# EasyEDA Pro project pcb最终版.epro, schematic master control
Create Date: 2023-09-30; Page Name: P1; Project Name: 工科大; Schematic Name: master control; Update Date: 2023-10-22; Company: 嘉立创EDA; Page Size: A4; Version: V1.0
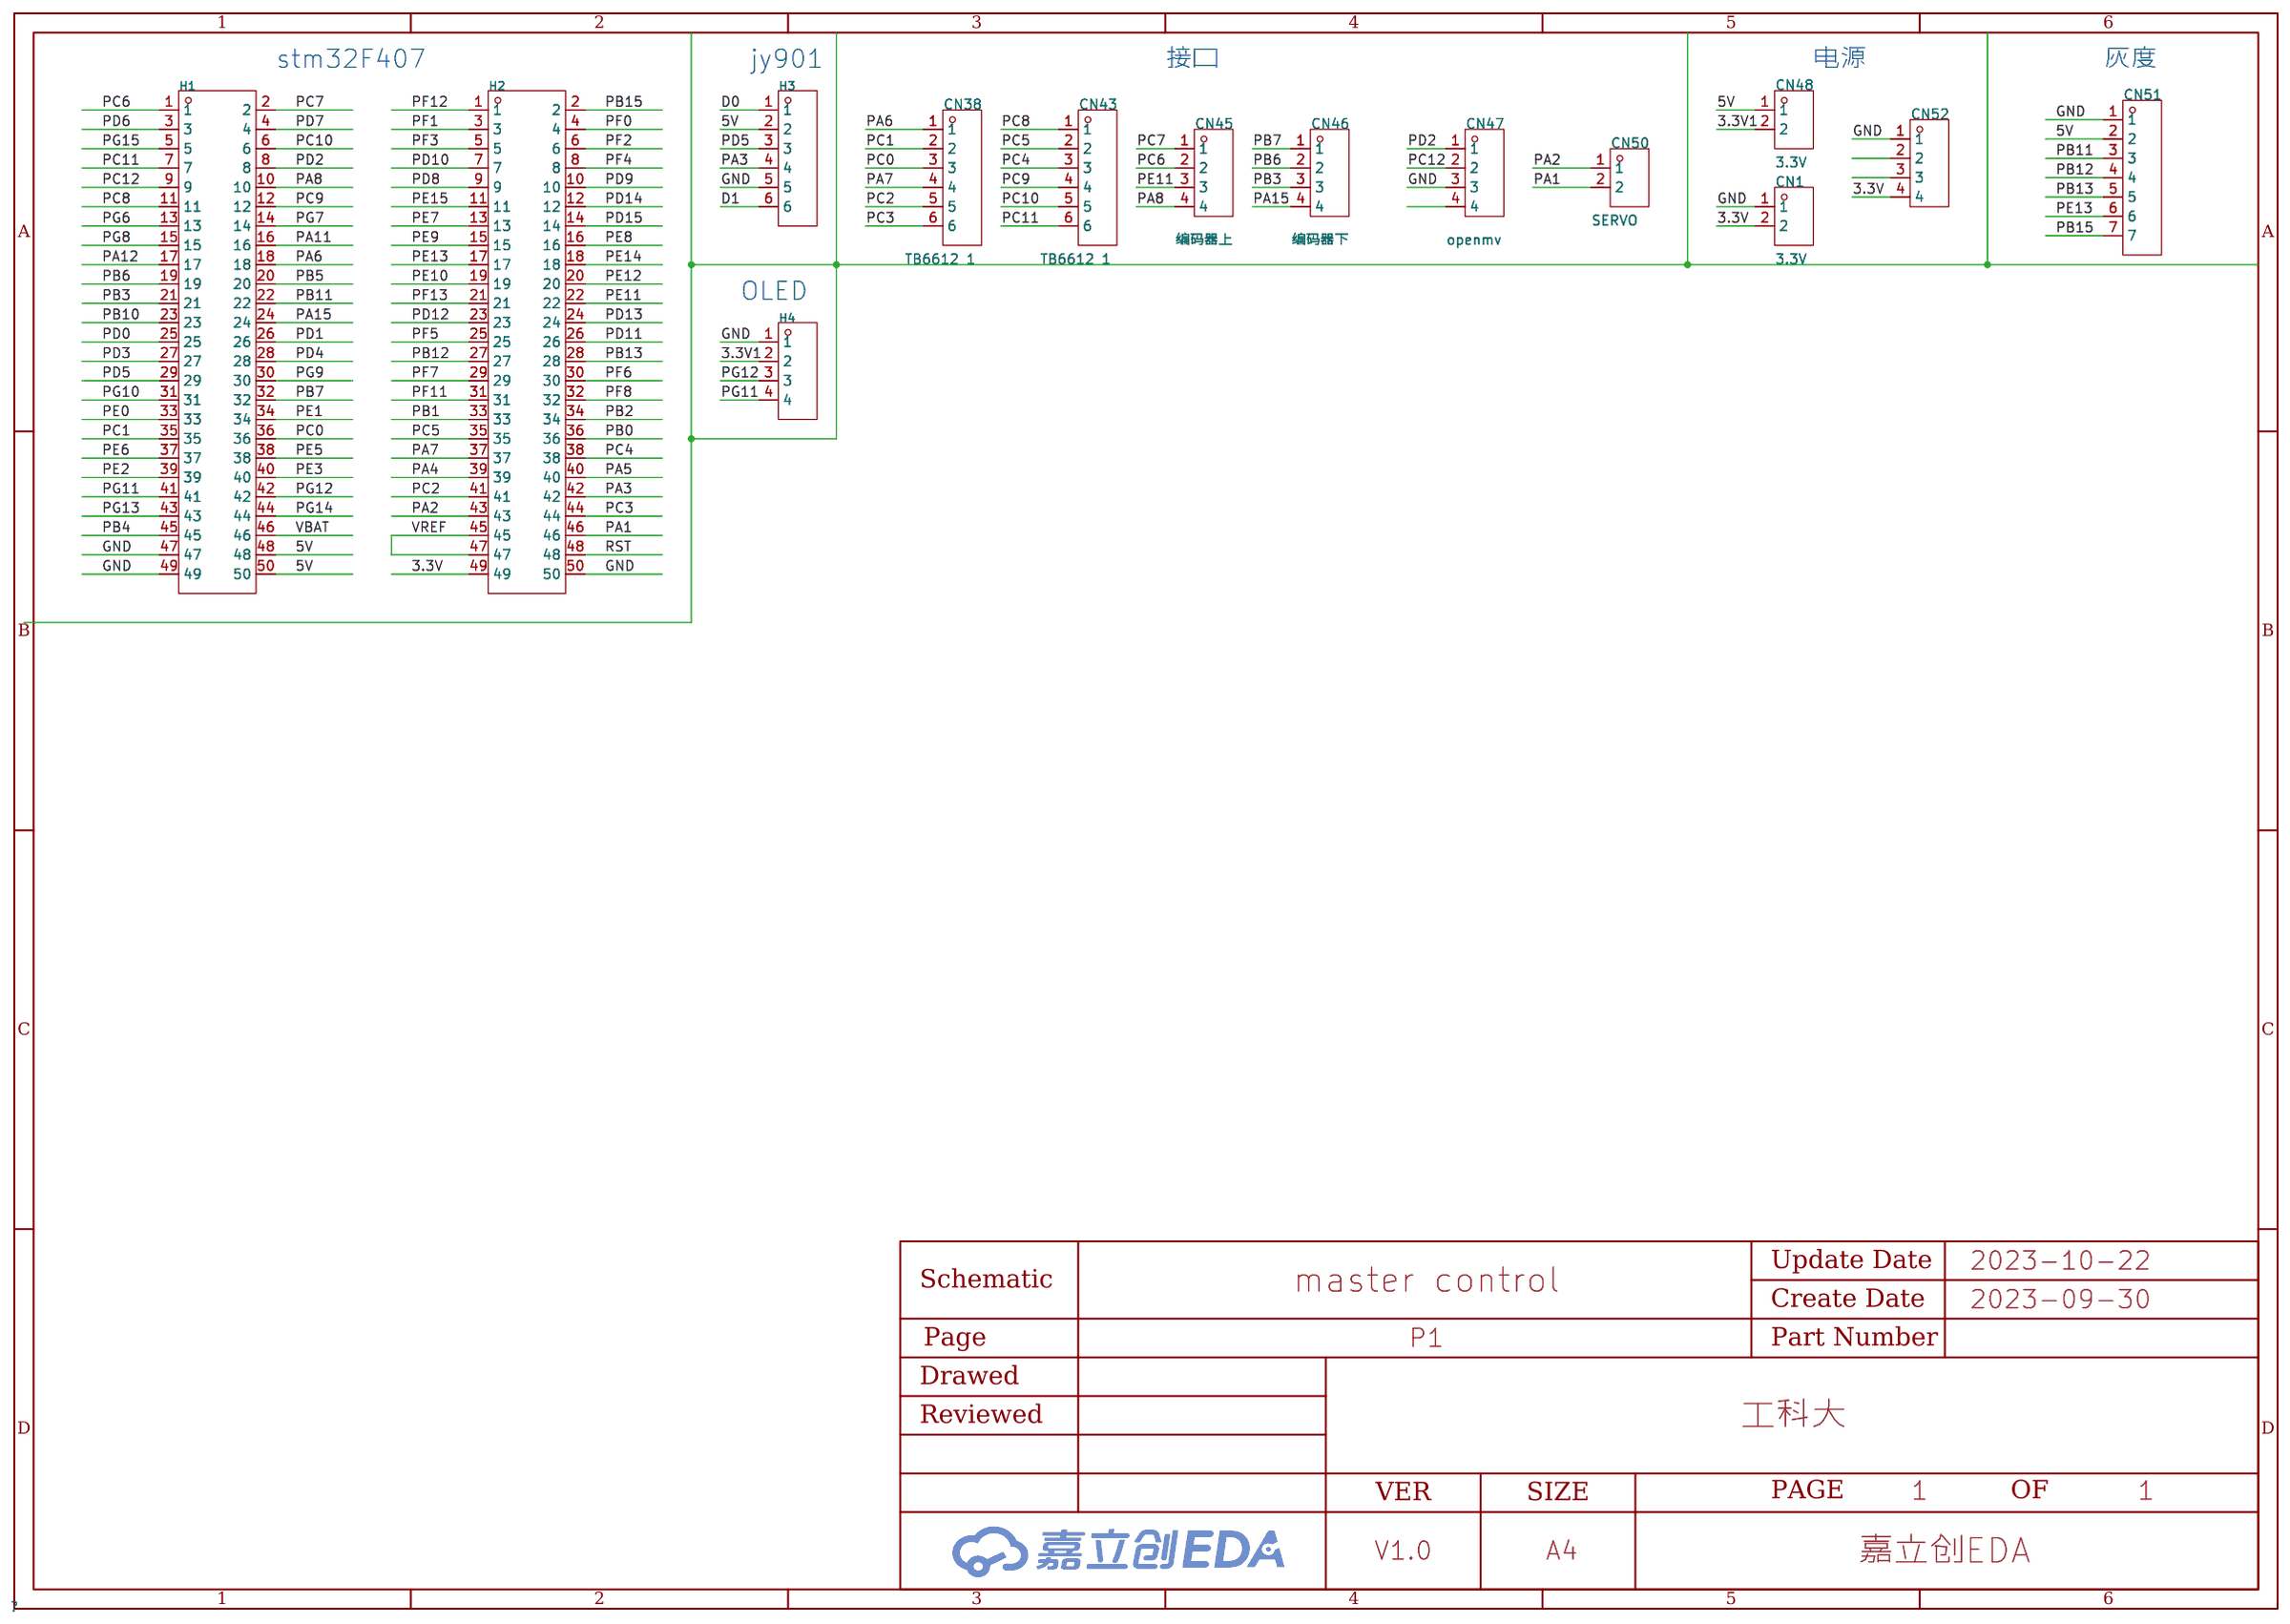
[diagram p2: schematic sheet]

## Parts
CN1  3.3V  [CONN-TH_XH-2AW_C2908611]
CN38  TB6612 1  [CONN-TH_6P-P2.50_HC-XH-6AW-G]
CN43  TB6612 1  [CONN-TH_6P-P2.50_HC-XH-6AW-G]
CN45  编码器上  [CONN-TH_XH-4AW]
CN46  编码器下  [CONN-TH_XH-4AW]
CN47  openmv  [CONN-TH_XH-4AW]
CN48  3.3V  [CONN-TH_XH-2AW_C2908611]
CN50  SERVO  [CONN-TH_XH-2AW_C2908611]
CN51  HC-XH-7AW-G  [CONN-TH_7P-P2.50_HC-XH-7AW-G]
CN52  XH-4AW  [CONN-TH_XH-4AW]
H1  FH-00077  [HDR-TH_50P-P2.54-V-F-R2-C25-S2.54-1]
H2  FH-00077  [HDR-TH_50P-P2.54-V-F-R2-C25-S2.54-1]
H3  PM254V-11-06-H85  [HDR-TH_6P-P2.54-V-F]
H4  PM254V-11-04-H85  [HDR-TH_4P-P2.54-V-F]

## Library data of the parts
CN1 CN48 CN50 = XH-2AW_C2908611: 参考系列:XH;间距:2.54mm;插针结构:1x2P;排数:1;每排PIN数:2;行距:-;公母:公型插针;安装方式:弯插;额定电流:3A;工作温度范围:-25℃~+85℃;; LCSC Part Name: XH 2.54mm 1x2P 弯插; Supplier Part: C2908611; Manufacturer: HCTL(华灿天禄); Supplier Footprint: 弯插,P=2.54mm; JLCPCB Part Class: 扩展库; Datasheet: https://atta.szlcsc.com/upload/public/pdf/source/20211021/ACA2D54D99493880102FCACAC8DAABA8.pdf; Supplier: LCSC; Reference Series: XH; Pitch: 2.54mm; Pins Structure: 1x2P; Number of Rows: 1; Number of PINs Per Row: 2; Gender: 公型插针; Mounting Style: 弯插; Current Rating (Max): 3A; Operating Temperature Range: -25℃~+85℃
CN38 CN43 = HC-XH-6AW-G: 参考系列:XH;间距:2.54mm;插针结构:1x6P;排数:1;每排PIN数:6;行距:2.54mm;公母:公型插针;安装方式:弯插;额定电流:3A;工作温度范围:-25℃~+85℃;; LCSC Part Name: XH 2.54mm 1x6P 弯插; Supplier Part: C5341212; Manufacturer: HCTL(华灿天禄); Supplier Footprint: 弯插,P=2.5mm; JLCPCB Part Class: 扩展库; Datasheet: https://atta.szlcsc.com/upload/public/pdf/source/20230105/4FFD2EFD3DA44AA828171A44400F3EDE.pdf; Supplier: LCSC; Reference Series: XH; Pitch: 2.54mm; Pins Structure: 1x6P; Number of Rows: 1; Number of PINs Per Row: 6; Row Spacing: 2.54mm; Gender: 公型插针; Mounting Style: 弯插; Current Rating (Max): 3A; Operating Temperature Range: -25℃~+85℃
CN45-CN47 CN52 = XH-4AW: 参考系列:XH;间距:2.54mm;插针结构:1x4P;排数:1;每排PIN数:4;行距:-;公母:公型插针;安装方式:弯插;额定电流:3A;工作温度范围:-25℃~+85℃;; LCSC Part Name: XH 2.54mm 1x4P 弯插; Supplier Part: C2908613; Manufacturer: HCTL(华灿天禄); Supplier Footprint: 插件,P=2.54mm; JLCPCB Part Class: 扩展库; Datasheet: https://atta.szlcsc.com/upload/public/pdf/source/20211021/ACA2D54D99493880102FCACAC8DAABA8.pdf; Supplier: LCSC; Reference Series: XH; Pitch: 2.54mm; Pins Structure: 1x4P; Number of Rows: 1; Number of PINs Per Row: 4; Gender: 公型插针; Mounting Style: 弯插; Current Rating (Max): 3A; Operating Temperature Range: -25℃~+85℃
CN51 = HC-XH-7AW-G: 参考系列:XH;间距:2.54mm;插针结构:1x7P;排数:1;每排PIN数:7;行距:2.54mm;公母:公型插针;安装方式:弯插;额定电流:3A;工作温度范围:-25℃~+85℃;; LCSC Part Name: XH 2.54mm 1x7P 弯插; Supplier Part: C5341213; Manufacturer: HCTL(华灿天禄); Supplier Footprint: 弯插,P=2.5mm; JLCPCB Part Class: 扩展库; Datasheet: https://atta.szlcsc.com/upload/public/pdf/source/20230105/4FFD2EFD3DA44AA828171A44400F3EDE.pdf; Supplier: LCSC; Reference Series: XH; Pitch: 2.54mm; Pins Structure: 1x7P; Number of Rows: 1; Number of PINs Per Row: 7; Row Spacing: 2.54mm; Gender: 公型插针; Mounting Style: 弯插; Current Rating (Max): 3A; Operating Temperature Range: -25℃~+85℃
H1 H2 = FH-00077: 排数:双排;总孔位数:50;间距:2.54mm;插孔结构:2x25P;行距:2.54mm;安装类型:直插;圆孔/方孔:方孔;额定电流:3A;额定电压:-;插孔方向:顶部;塑高:8.5mm;触头材质:黄铜;触头镀层:金;工作温度范围:-40℃~+105℃;焊接温度(最大值):200℃@10S;; LCSC Part Name: 2.54mm 2x25P; Supplier Part: C2829906; Manufacturer: Liansheng(连盛); Supplier Footprint: 直插,P=2.54mm; JLCPCB Part Class: 扩展库; Supplier: LCSC; Number of Rows: 双排; Number of Holes: 50; Pitch: 2.54mm; Holes Structure: 2x25P; Row Spacing: 2.54mm; Mounting Type: 直插; Circular Hole / Square Hole: 方孔; Current Rating (Max): 3A; Holes Direction: 顶部; Insulation Height: 8.5mm; Contact Material: 黄铜; Contact Plating: 金; Operating Temperature Range: -40℃~+105℃; Welding Temperature (Max): 200℃@10S
H3 = PM254V-11-06-H85: 排数:单排;总孔位数:6P;间距:2.54mm;插孔结构:1x6P;行距:-;安装类型:直插;圆孔/方孔:方孔;额定电流:3A;额定电压:250V;插孔方向:顶部;塑高:-;工作温度范围:-40℃~+105℃;; LCSC Part Name: 2.54mm 1x6P; Supplier Part: C2832269; Manufacturer: XFCN(兴飞); Supplier Footprint: 插件,P=2.54mm; JLCPCB Part Class: 扩展库; Datasheet: https://atta.szlcsc.com/upload/public/pdf/source/20210514/C2832269_B3EC97736B37C2783BDCE3050AA57447.pdf; Supplier: LCSC; Number of Rows: 单排; Number of Holes: 6P; Pitch: 2.54mm; Holes Structure: 1x6P; Mounting Type: 直插; Circular Hole / Square Hole: 方孔; Current Rating (Max): 3A; Voltage Rating (Max): 250V; Holes Direction: 顶部; Operating Temperature Range: -40℃~+105℃
H4 = PM254V-11-04-H85: 排数:单排;总孔位数:4;间距:2.54mm;插孔结构:1x4P;行距:-;安装类型:直插;塑高:-;触头材质:黄铜;触头镀层:-;; LCSC Part Name: 2.54mm 1x4P; Supplier Part: C541851; Manufacturer: XFCN(兴飞); Supplier Footprint: 直插,P=2.54mm; Supplier: LCSC; Number of Rows: 单排; Number of Holes: 4; Pitch: 2.54mm; Holes Structure: 1x4P; Mounting Type: 直插; Contact Material: 黄铜

## Nets
3.3V: CN1.2 CN52.4 H2.49
3.3V1: CN48.2 H4.2
5V: CN48.1 CN51.2 H1.48 H1.50 H3.2
GND: CN1.1 CN47.3 CN51.1 CN52.1 H1.47 H1.49 H2.50 H3.5 H4.1
VBAT: H1.46
D0: H3.1
D1: H3.6
PA1: CN50.2 H2.46
PA2: CN50.1 H2.43
PA3: H2.42 H3.4
PA4: H2.39
PA5: H2.40
PA6: CN38.1 H1.18
PA7: CN38.4 H2.37
PA8: CN45.4 H1.10
PA11: H1.16
PA12: H1.17
PA15: CN46.4 H1.24
PB0: H2.36
PB1: H2.33
PB2: H2.34
PB3: CN46.3 H1.21
PB4: H1.45
PB5: H1.20
PB6: CN46.2 H1.19
PB7: CN46.1 H1.32
PB10: H1.23
PB11: CN51.3 H1.22
PB12: CN51.4 H2.27
PB13: CN51.5 H2.28
PB15: CN51.7 H2.2
PC0: CN38.3 H1.36
PC1: CN38.2 H1.35
PC2: CN38.5 H2.41
PC3: CN38.6 H2.44
PC4: CN43.3 H2.38
PC5: CN43.2 H2.35
PC6: CN45.2 H1.1
PC7: CN45.1 H1.2
PC8: CN43.1 H1.11
PC9: CN43.4 H1.12
PC10: CN43.5 H1.6
PC11: CN43.6 H1.7
PC12: CN47.2 H1.9
PD0: H1.25
PD1: H1.26
PD2: CN47.1 H1.8
PD3: H1.27
PD4: H1.28
PD5: H1.29 H3.3
PD6: H1.3
PD7: H1.4
PD8: H2.9
PD9: H2.10
PD10: H2.7
PD11: H2.26
PD12: H2.23
PD13: H2.24
PD14: H2.12
PD15: H2.14
PE0: H1.33
PE1: H1.34
PE2: H1.39
PE3: H1.40
PE5: H1.38
PE6: H1.37
PE7: H2.13
PE8: H2.16
PE9: H2.15
PE10: H2.19
PE11: CN45.3 H2.22
PE12: H2.20
PE13: CN51.6 H2.17
PE14: H2.18
PE15: H2.11
PF0: H2.4
PF1: H2.3
PF2: H2.6
PF3: H2.5
PF4: H2.8
PF5: H2.25
PF6: H2.30
PF7: H2.29
PF8: H2.32
PF11: H2.31
PF12: H2.1
PF13: H2.21
PG6: H1.13
PG7: H1.14
PG8: H1.15
PG9: H1.30
PG10: H1.31
PG11: H1.41 H4.4
PG12: H1.42 H4.3
PG13: H1.43
PG14: H1.44
PG15: H1.5
RST: H2.48
VREF: H2.45 H2.47

Not connected (* = marked no-connect by the designer): CN47 4; CN52 2 3

## Notes on the sheet
- stm32F407
- jy901
- 接口
- 电源
- 灰度
- OLED
